# EAGLE schematic tinycurrent (EAGLE 6.3)
TinyCurrent RMS Power Monitor
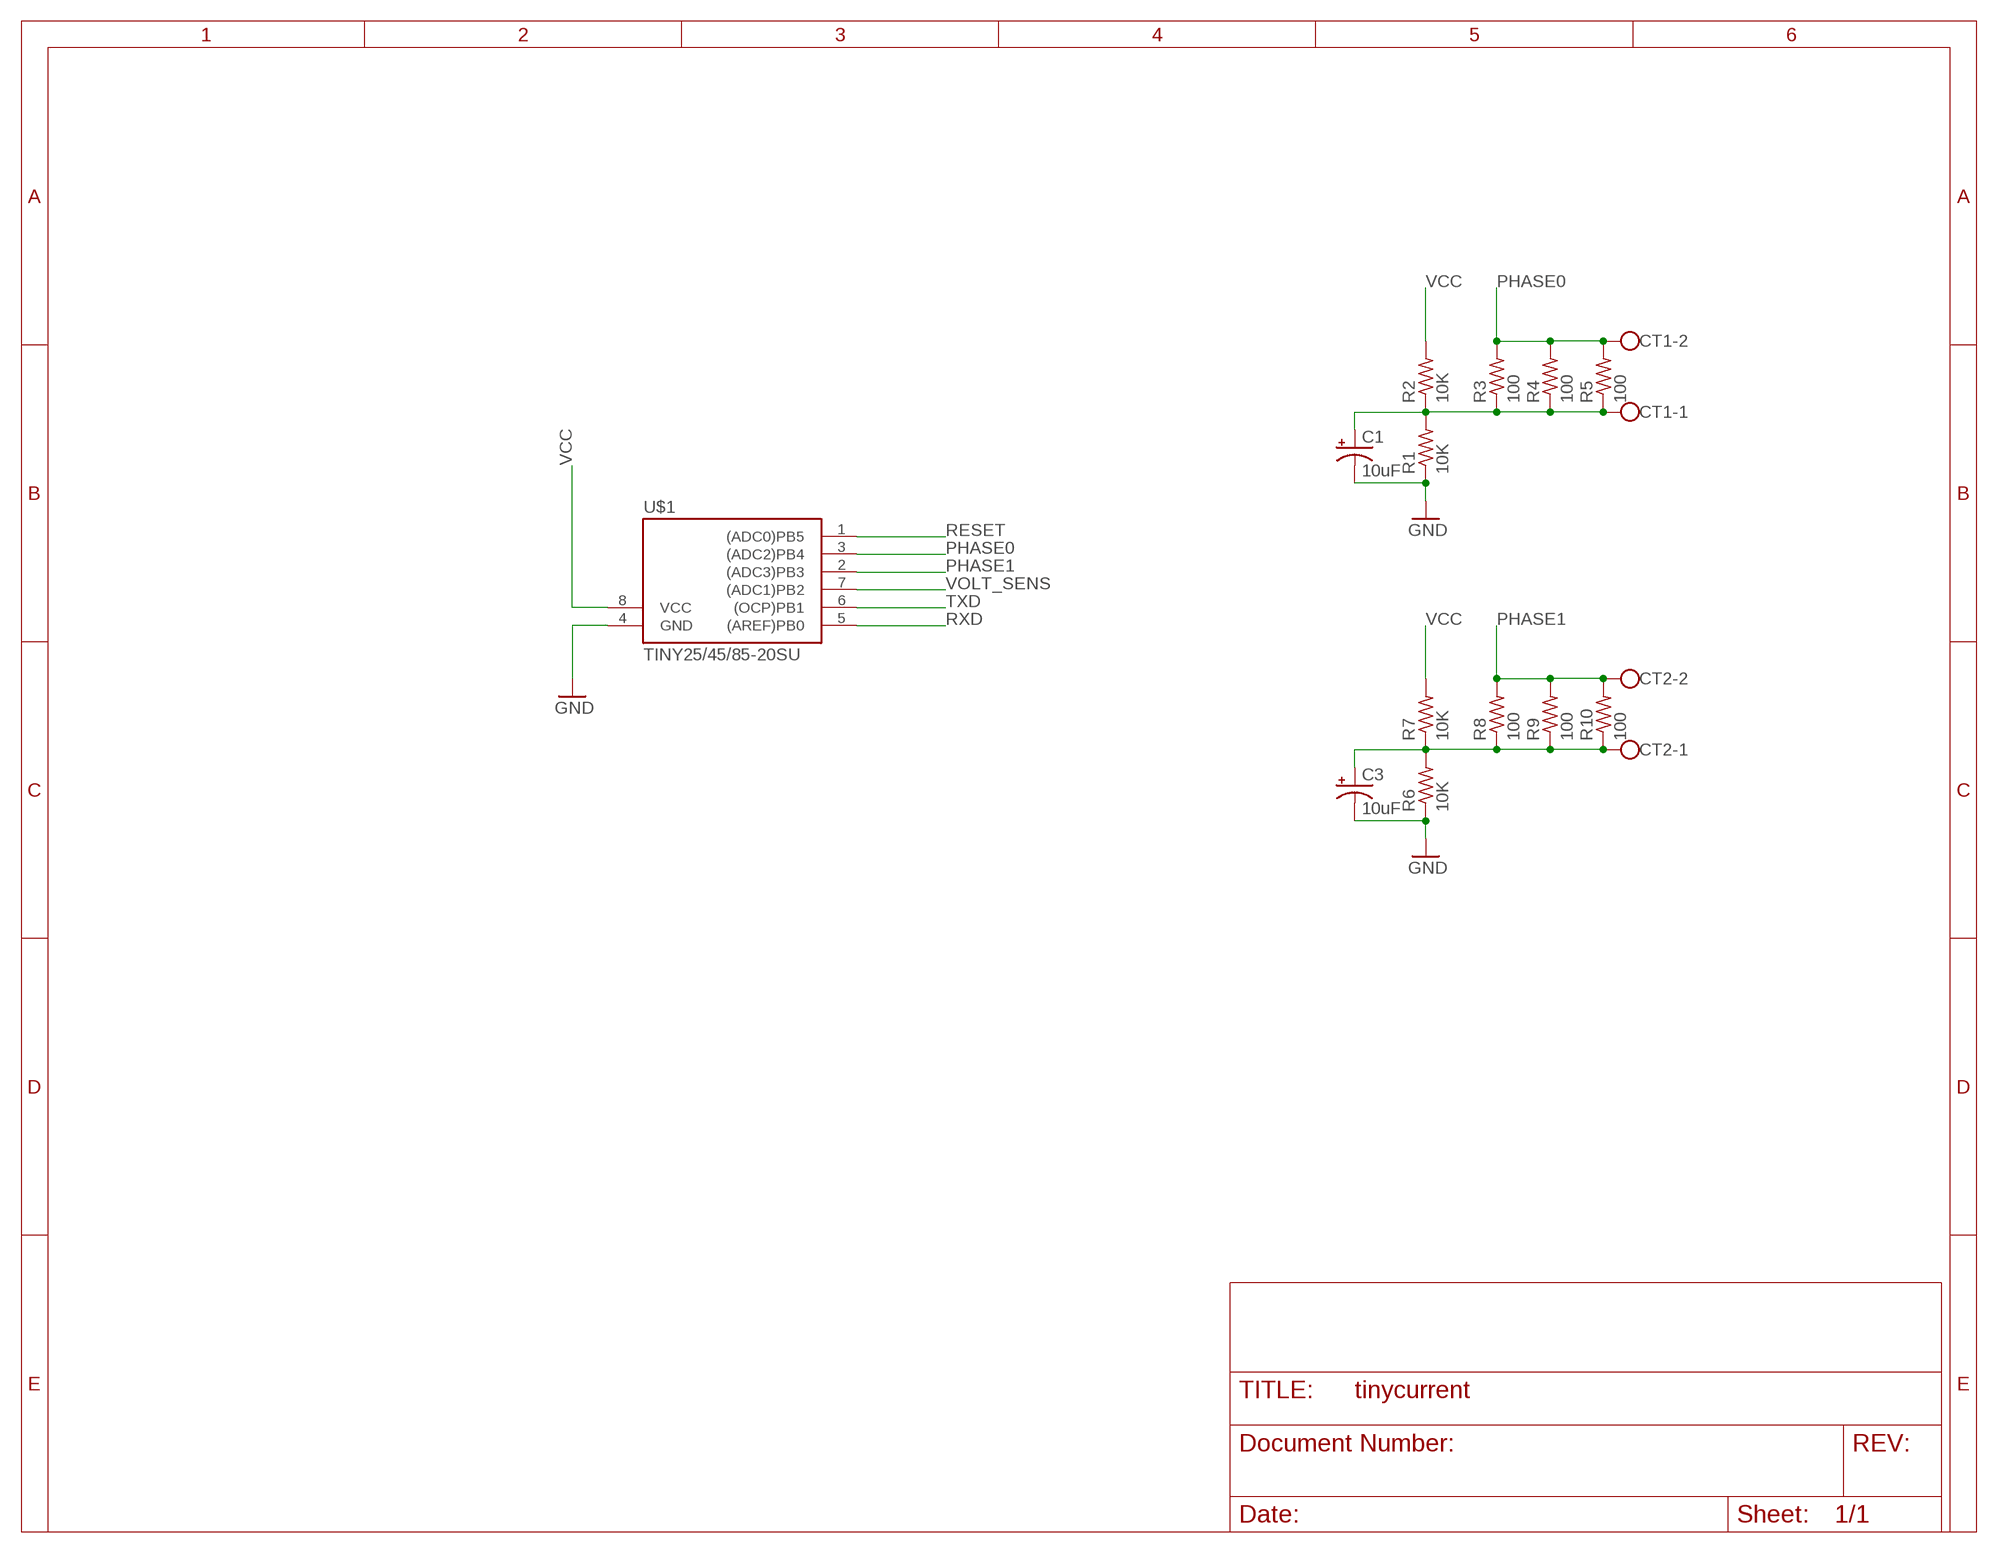
[diagram p0: schematic, sheet 1]

## Parts
C1  10uF  CPOL-USE5-8.5  [E5-8,5]
C3  10uF  CPOL-USE5-8.5  [E5-8,5]
CT1  W237-102  [W237-102]
CT2  W237-102  [W237-102]
R1  10K  R-US_0207/10  [0207/10]
R2  10K  R-US_0207/10  [0207/10]
R3  100  R-US_0207/10  [0207/10]
R4  100  R-US_0207/10  [0207/10]
R5  100  R-US_0207/10  [0207/10]
R6  10K  R-US_0207/10  [0207/10]
R7  10K  R-US_0207/10  [0207/10]
R8  100  R-US_0207/10  [0207/10]
R9  100  R-US_0207/10  [0207/10]
R10  100  R-US_0207/10  [0207/10]
U$1  TINY25/45/85-20SU  [SOIC8]

## Nets
GND: C1.- C3.- R1.1 R6.1 U$1.4(GND)
N$1: C3.+ CT2.1 R6.2 R7.1 R8.1 R9.1 R10.1
N$3: C1.+ CT1.1 R1.2 R2.1 R3.1 R4.1 R5.1
PHASE0: CT1.2 R3.2 R4.2 R5.2 U$1.3((ADC2)PB4)
PHASE1: CT2.2 R8.2 R9.2 R10.2 U$1.2((ADC3)PB3)
RESET: U$1.1((ADC0)PB5)
RXD: U$1.5((AREF)PB0)
TXD: U$1.6((OCP)PB1)
VCC: R2.2 R7.2 U$1.8(VCC)
VOLT_SENS: U$1.7((ADC1)PB2)

## Library data of the parts
C1 C3 = rcl:CPOL-US: POLARIZED CAPACITOR, American symbol
CT1 CT2 = con-wago-500:W237-102: WAGO SCREW CLAMP; MPN: 237-102; OC_FARNELL: unknown; OC_NEWARK: 70K9898
R1-R10 = rcl:R-US_: RESISTOR, American symbol
U$1 = avr-6:TINY25/45/85